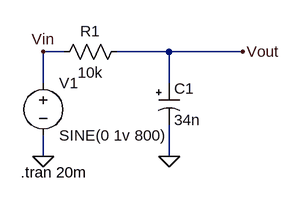
[diagram p0: schematic passaBaixa.asc]
passaBaixa.asc, the LTspice schematic file:
Version 4
SHEET 1 880 680
WIRE 48 128 16 128
WIRE 208 128 128 128
WIRE 320 128 208 128
WIRE 16 176 16 128
WIRE 208 176 208 128
WIRE 16 288 16 256
WIRE 208 288 208 240
FLAG 16 288 0
FLAG 208 288 0
FLAG 16 128 Vin
FLAG 320 128 Vout
SYMBOL res 144 112 R90
WINDOW 0 0 56 VBottom 2
WINDOW 3 32 56 VTop 2
SYMATTR InstName R1
SYMATTR Value 10k
SYMBOL voltage 16 160 R0
WINDOW 123 0 0 Left 0
WINDOW 39 0 0 Left 0
SYMATTR InstName V1
SYMATTR Value SINE(0 1v 800)
SYMBOL polcap 192 176 R0
SYMATTR InstName C1
SYMATTR Value 34n
TEXT -18 312 Left 2 !.tran 20m

The netlist it stands for:
* passaBaixa.asc
R1 Vout Vin 10k
V1 Vin 0 SINE(0 1v 800)
C1 Vout 0 34n
.tran 20m
.backanno
.end